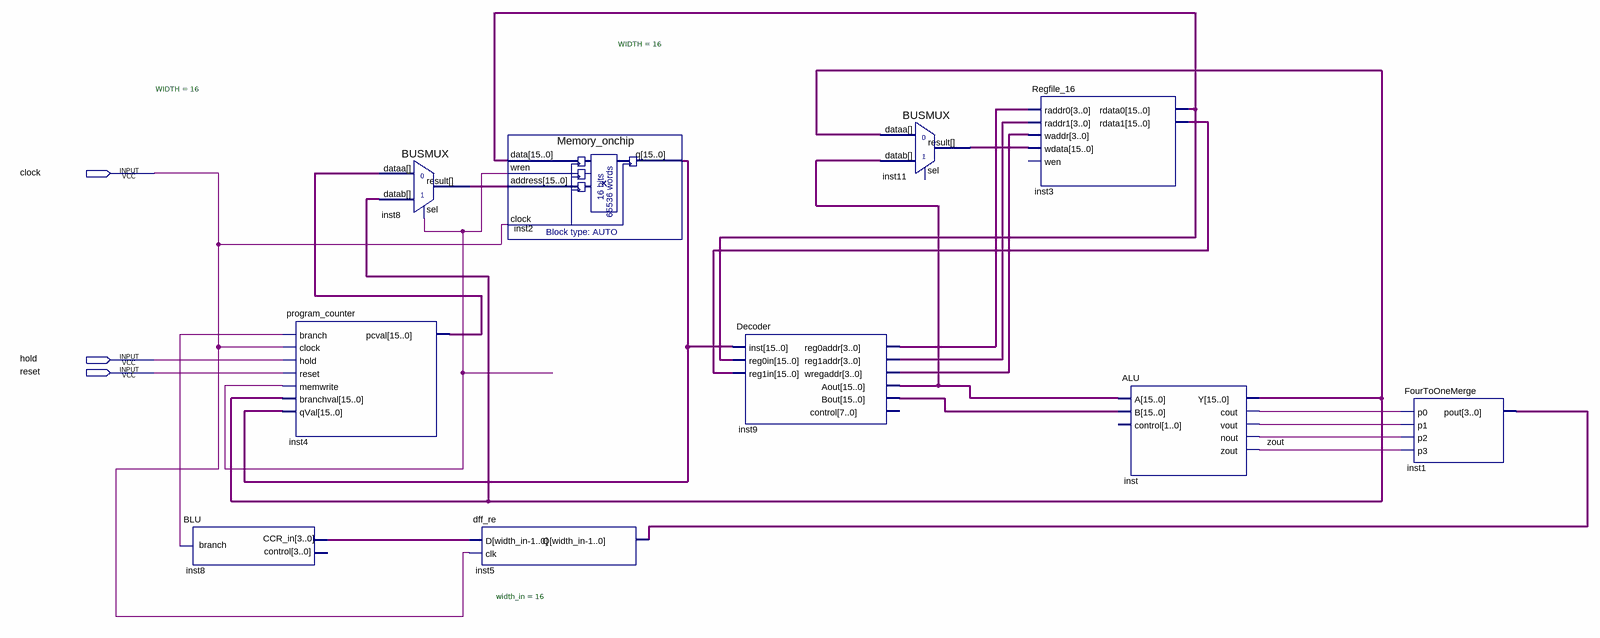
[diagram p0: schematic sheet]
// Quartus schematic TIPS_architecture.bdf as structural Verilog: 10 symbols, 3 pins
module TIPS_architecture (
  input  clock,
  input  hold,
  input  reset
);

  wire inst8_branch, inst_cout, inst_nout, inst_vout, undriven_2, zout;
  wire [3:0] inst9_reg0addr, inst9_reg1addr, inst9_wregaddr;
  wire [15:0] inst2_q, inst3_rdata0, inst3_rdata1, inst4_pcval, inst5_q, inst8_result, inst9_aout,
       inst9_bout, inst11_result, inst_y, undriven;

  BLU inst8 (.CCR_in(undriven), .branch(inst8_branch));  // open: control
  program_counter inst4 (
    .branch(inst8_branch), .clock(clock), .hold(hold), .reset(reset), .memwrite(undriven_2),
    .branchval(inst_y), .qVal(inst2_q), .pcval(inst4_pcval));
  BUSMUX #(.WIDTH(16)) inst8_dup2 (.datab(inst_y), .sel(undriven_2), .dataa(inst4_pcval), .result(inst8_result));
  dff_re #(.width_in(16)) inst5 (.D(undriven), .clk(clock), .Q(inst5_q));
  Memory_onchip inst2 (.data(inst3_rdata0), .wren(undriven_2), .address(inst8_result), .clock(clock), .q(inst2_q));
  Decoder inst9 (
    .inst(inst2_q), .reg0in(inst3_rdata0), .reg1in(inst3_rdata1), .reg0addr(inst9_reg0addr),
    .reg1addr(inst9_reg1addr), .wregaddr(inst9_wregaddr), .Aout(inst9_aout), .Bout(inst9_bout));  // open: control
  BUSMUX #(.WIDTH(16)) inst11 (.datab(inst9_aout), .dataa(inst_y), .result(inst11_result));  // open: sel
  Regfile_16 inst3 (
    .raddr0(inst9_reg0addr), .raddr1(inst9_reg1addr), .waddr(inst9_wregaddr), .wdata(inst11_result),
    .rdata0(inst3_rdata0), .rdata1(inst3_rdata1));  // open: wen
  ALU inst (
    .A(inst9_aout), .B(inst9_bout), .Y(inst_y), .cout(inst_cout), .vout(inst_vout), .nout(inst_nout),
    .zout(zout));  // open: control
  FourToOneMerge inst1 (.p0(inst_cout), .p1(inst_vout), .p2(inst_nout), .p3(zout), .pout(inst5_q));
endmodule
